# EasyEDA Pro project 穿越机H7飞控工程文件（241123）.epro, board PCB3
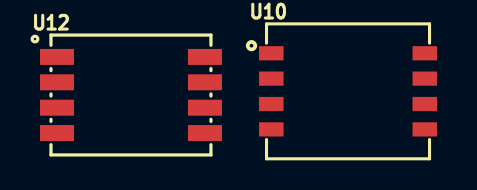
[diagram p24: board, top side]
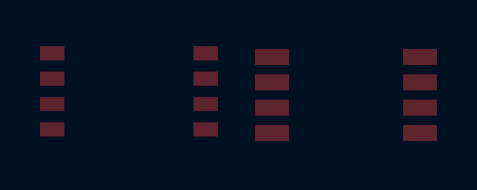
[diagram p25: board, bottom side, seen from below]

No outline. copper layers: Top Layer, Bottom Layer. Coordinates in mm from the lowest, leftmost part position.
Stack: Top Layer 0.035mm / Dielectric1 1.51mm FR4 er 4.5 / Bottom Layer 0.035mm

## Design rules (mm)
template: JLCPCB Capability(Two Layers Board)
spacing copperThickness1oz (default): track to track 0.102, other pairs 0.152 to 0.3
spacing copperThickness2oz: track to track 0.203, other pairs 0.152 to 0.3
track width copperThickness1oz (default): min 0.127, default 0.254, max 2.54
track width copperThickness2oz: min 0.203, default 0.254, max 2.54
differential pair differentialPair (default): width min 0.127, default 0.254, max 2.54; gap min 0.152, default 0.152
via viaSize (default): diameter min 0.5, default 0.61, max 10; hole min 0.3, default 0.305, max 6.3

## Placement (name value [footprint] x y rotation side)
U10  MKDV16GCL-STP  [LGA-8_L8.0-W6.6-P1.27-TL_MKDV16GCL-STP]  10.86 0.18 0 top
U12  CSNP1GCR01-BOW  [LGA-8_L6.0-W8.0-P1.27-TL]  0 0 0 top

## Footprints (pads in the part's own frame, mm; a bottom-side part is the same pattern mirrored in y, then rotated)
LGA-8_L6.0-W8.0-P1.27-TL
  rect 1.7x0.8 smd: 1(-3.7,1.905) 2(-3.7,0.635) 3(-3.7,-0.635) 4(-3.7,-1.905) 5(3.7,-1.905) 6(3.7,-0.635) 7(3.7,0.635) 8(3.7,1.905)
LGA-8_L8.0-W6.6-P1.27-TL_MKDV16GCL-STP
  rect 1.225x0.711 smd: 1(-3.837,1.905) 2(-3.837,0.635) 3(-3.837,-0.635) 4(-3.837,-1.905) 5(3.837,-1.905) 6(3.837,-0.635) 7(3.837,0.635) 8(3.837,1.905)

## Nets

Pads without a net: U10 1 2 3 4 5 6 7 8; U12 1 2 3 4 5 6 7 8
